# EAGLE design DataLogger (EAGLE 6.3)
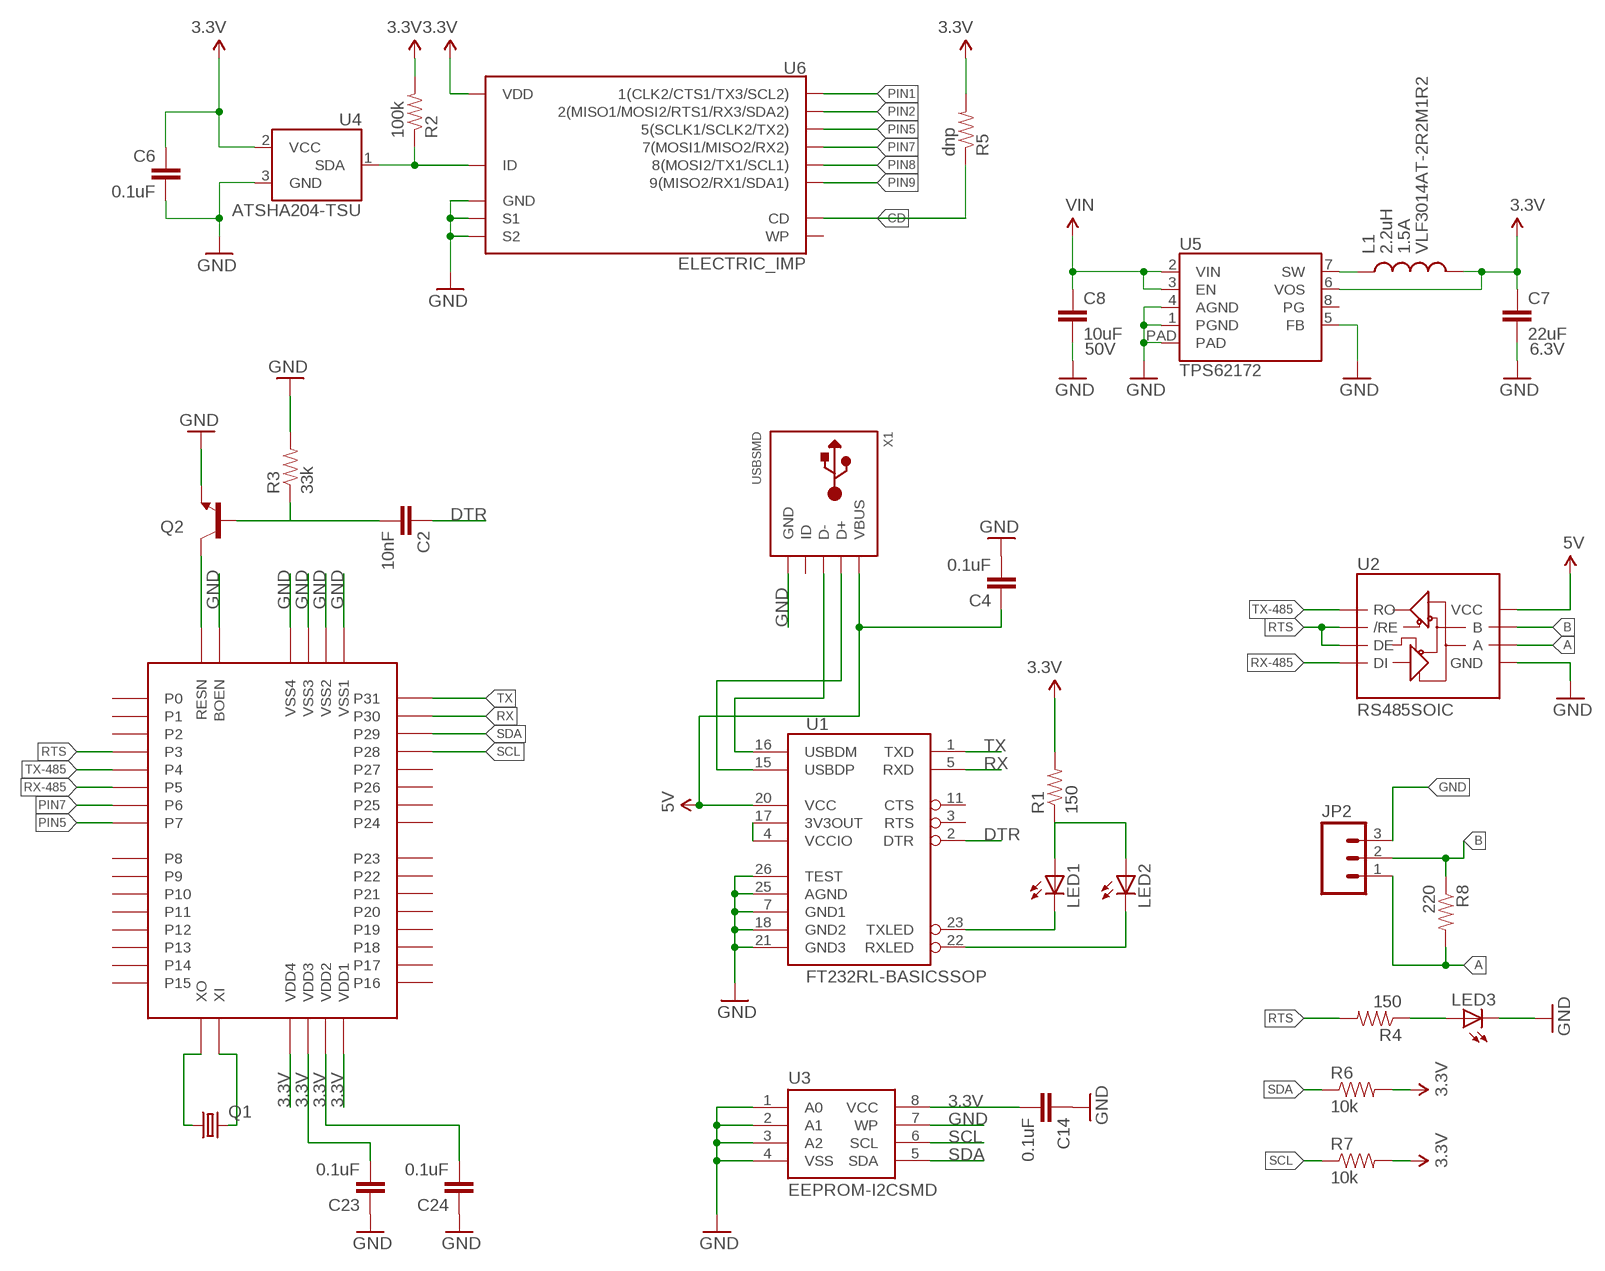
[diagram p0: schematic, sheet 1]

## Parts
C2  10nF  CAP0805  [0805]
C4  0.1uF  CAP1210  [1210]
C6  0.1uF  0.1UF-25V(+80/-20%)(0603)  [0603-CAP]
C7  22uF  22UF-6.3V-20%(0805)  [0805]
C8  10uF  10UF50V20%(1210)  [1210]
C14  0.1uF  CAP0805  [0805]
C23  0.1uF  CAP0805  [0805]
C24  0.1uF  CAP0805  [0805]
JP2  M03PTH  [1X03]
L1  2.2uH  INDUCTORVLF4012A  [VLF4012A]
LED1  LED1206  [LED-1206]
LED2  LED1206  [LED-1206]
LED3  LED1206  [LED-1206]
Q1  CRYSTALSM49  [SM49]
Q2  TRANSISTOR_NPNSOT23  [SOT23]
R1  150  RESISTOR0805-RES  [0805]
R2  100k  100KOHM1/10W1%(0603)  [0603-RES]
R3  33k  RESISTOR0805-RES  [0805]
R4  150  RESISTOR0805-RES  [0805]
R5  dnp  RESISTOR0603  [0603-RES]
R6  10k  RESISTOR0805-RES  [0805]
R7  10k  RESISTOR0805-RES  [0805]
R8  220  RESISTOR0805-RES  [0805]
U1  FT232RL-BASICSSOP  [SSOP28DB]
U2  RS485SOIC  [SO08]
U3  EEPROM-I2CSMD  [SO08]
U4  ATSHA204-TSU  [SOT23-3]
U5  TPS62172  [WSON-8-PAD]
U6  ELECTRIC_IMP  [SD_1:1]
U7  PROPELLERSURFACELQFP  [SURFACEMOUNT]
X1  USBSMD  USBMINIB  [USB-MINIB]

## Nets
3.3V: C6.1 C7.1 C14.2 C23.2 C24.2 L1.P$2 R1.2 R2.2 R5.2 R6.2 R7.2 U3.8(VCC) U4.2(VCC) U5.6(VOS) U6.4(VDD) U7.8(VDD1) U7.18(VDD2) U7.30(VDD3) U7.40(VDD4)
5V: C4.1 C8.1 U1.20(VCC) U2.8(VCC) U5.2(VIN) U5.3(EN) X1.VBUS ; supply symbol labelled VIN
A: JP2.1 R8.2 U2.6(A)
B: JP2.2 R8.1 U2.7(B)
CD: R5.1 U6.CD
DTR: C2.1 C2.2 Q2.1(B) R3.1 U1.2(DTR)
GND: C4.2 C6.2 C7.2 C8.2 C14.1 C23.1 C24.1 JP2.3 LED3.C Q2.2(E) R3.2 U1.7(GND1) U1.18(GND2) U1.21(GND3) U1.25(AGND) U1.26(TEST) U2.5(GND) U3.1(A0) U3.2(A1) U3.3(A2) U3.4(VSS) U3.7(WP) U4.3(GND) U5.1(PGND) U5.4(AGND) U5.5(FB) U5.PAD U6.3(GND) U6.SH@1(S1) U6.SH@2(S2) U7.5(VSS1) U7.6(BOEN) U7.17(VSS2) U7.27(VSS3) U7.39(VSS4) X1.GND
ID: R2.1 U4.1(SDA) U6.6(ID)
N$1: U1.16(USBDM) X1.D-
N$2: U1.15(USBDP) X1.D+
N$3: Q2.3(C) U7.7(RESN)
N$4: U1.4(VCCIO) U1.17(3V3OUT)
N$5: Q1.2 U7.28(XI)
N$6: Q1.1 U7.29(XO)
N$7: L1.P$1 U5.7(SW)
N$8: LED1.C U1.23(TXLED)
N$9: LED2.C U1.22(RXLED)
N$10: LED1.A LED2.A R1.1
N$13: LED3.A R4.1
PIN1: U6.1(1(CLK2/CTS1/TX3/SCL2))
PIN2: U6.2(2(MISO1/MOSI2/RTS1/RX3/SDA2))
PIN5: U6.5(5(SCLK1/SCLK2/TX2)) U7.4(P7)
PIN7: U6.7(7(MOSI1/MISO2/RX2)) U7.3(P6)
PIN8: U6.8(8(MOSI2/TX1/SCL1))
PIN9: U6.9(9(MISO2/RX1/SDA1))
RTS: R4.2 U2.2(/RE) U2.3(DE) U7.44(P3)
RX: U1.5(RXD) U7.37(P30)
RX-485: U2.4(DI) U7.2(P5)
SCL: R7.1 U3.6(SCL) U7.35(P28)
SDA: R6.1 U3.5(SDA) U7.36(P29)
TX: U1.1(TXD) U7.38(P31)
TX-485: U2.1(RO) U7.1(P4)
Unconnected: U1.3(RTS) U1.11(CTS) U5.8(PG) U6.WP U7.9(P8) U7.10(P9) U7.11(P10) U7.12(P11) U7.13(P12) U7.14(P13) U7.15(P14) U7.16(P15) U7.19(P16) U7.20(P17) U7.21(P18) U7.22(P19) U7.23(P20) U7.24(P21) U7.25(P22) U7.26(P23) U7.31(P24) U7.32(P25) U7.33(P26) U7.34(P27) U7.41(P0) U7.42(P1) U7.43(P2) X1.ID

## Notes on the sheet
- 1.5A | VLF3014AT-2R2M1R2
- 50V | 6.3V

## Library data of the parts
C2 C4 C14 C23 C24 = SparkFun:CAP: Capacitor Standard 0603 ceramic capacitor, and 0.1" leaded capacitor.
C6 = SparkFun-Capacitors:0.1UF-25V(+80/-20%)(0603): CAP-00810 Ceramic Standard decoupling cap; PROD_ID: CAP-00810
C7 = SparkFun-Capacitors:22UF-6.3V-20%(0805): CAP-08402 Ceramic; PROD_ID: CAP-08402
C8 = SparkFun-Capacitors:10UF50V20%(1210): CAP-09824; PROD_ID: CAP-09824
JP2 = SparkFun:M03: Header 3 Standard 3-pin 0.1" header. Use with straight break away headers (SKU : PRT-00116), right angle break away headers (PRT-00553), swiss pins (PRT-00743), machine pins (PRT-00117), and female headers (PRT-00115). Molex polarized connector foot print use with SKU : PRT-08232 with associated crimp pins and housings.
L1 = SparkFun-Passives:INDUCTOR: Inductors Basic Inductor/Choke - 0603 and 1206. Footprints are not proven and vary greatly between part numbers.
LED1-LED3 = SparkFun-LED:LED: LEDs Standard schematic elements and footprints for 5mm, 3mm, 1206, and 0603 sized LEDs. 5mm - Spark Fun Electronics SKU : COM-00529 (and others)
Q1 = crystal:CRYSTAL: CRYSTAL; OC_FARNELL: unknown; OC_NEWARK: unknown
Q2 = SparkFun:TRANSISTOR_NPN: Transistor NPN BJT configuration in SOT23 package. MMBT2222 is the common NPN we use. Double check BCE configuration again layout.
R1 R3 R4 R6-R8 = SparkFun:RESISTOR: Resistor Basic schematic elements and footprints for 0603, 1206, and PTH resistors.
R2 = SparkFun-Resistors:100KOHM1/10W1%(0603): RES-07828; PROD_ID: RES-07828
R5 = SparkFun-Resistors:RESISTOR: Resistor Basic schematic elements and footprints for 0603, 1206, and PTH resistors.
U1 = SparkFun-DigitalIC:FT232RL-BASIC: USB UART This is the simplified version of the FT232RL unit. Only what you need, nothing you don't. Spark Fun Electronics SKU : COM-00650
U2 = SparkFun-DigitalIC:RS485: RS485 transceiver
U3 = SparkFun-DigitalIC:EEPROM-I2C: I2C EEPROM chips, 24LC256 (and others)
U4 = SparkFun-DigitalIC:ATSHA204
U5 = SparkFun-PowerIC:TPS62172
U6 = SparkFun-RF:ELECTRIC_IMP: Electric Imp SD Socket This symbol matches the Electric Imp <https://www.sparkfun.com/products/11395> pinout to a 4UCONN SD MMC connector. The 4UCONN part number is 19646 <http://www.4uconnector.com/online/Itemadrawing.asp?fldseries=19646&seriesno_a=12>. See this part in action on the Electric Imp Breakout <https://www.sparkfun.com/products/11400>.; PROD_ID: CONN-11976
U7 = JustinCustom:PROPELLERSURFACE
X1 = adafruit:USB: USB Connectors USBMINIB - Surface Mount Female Mini-B USB Connector 4UConnector: 06564 By microbuilder.eu Thru-hole RA Female Mini-B USB Connector 4UConnector: 18732 By ladyada.net

## Board
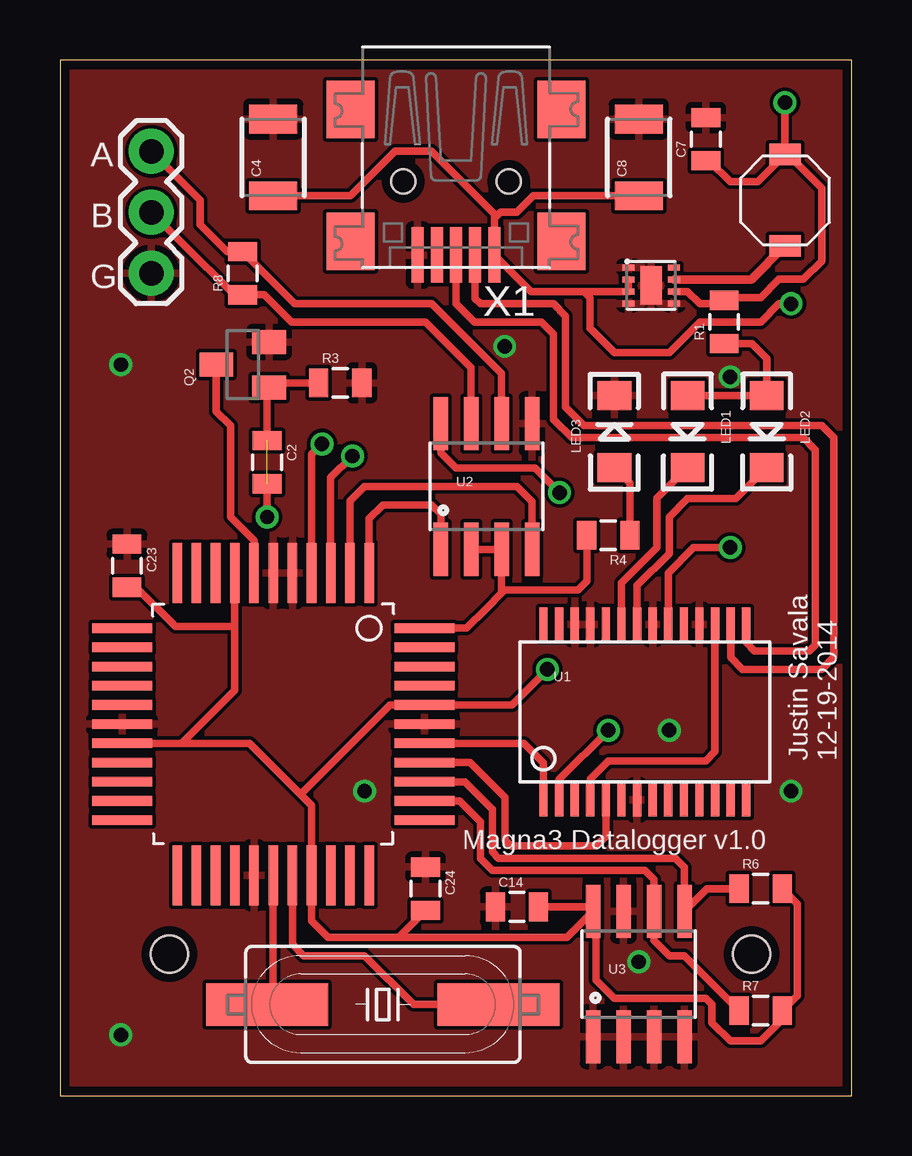
[diagram p1: board, top side]
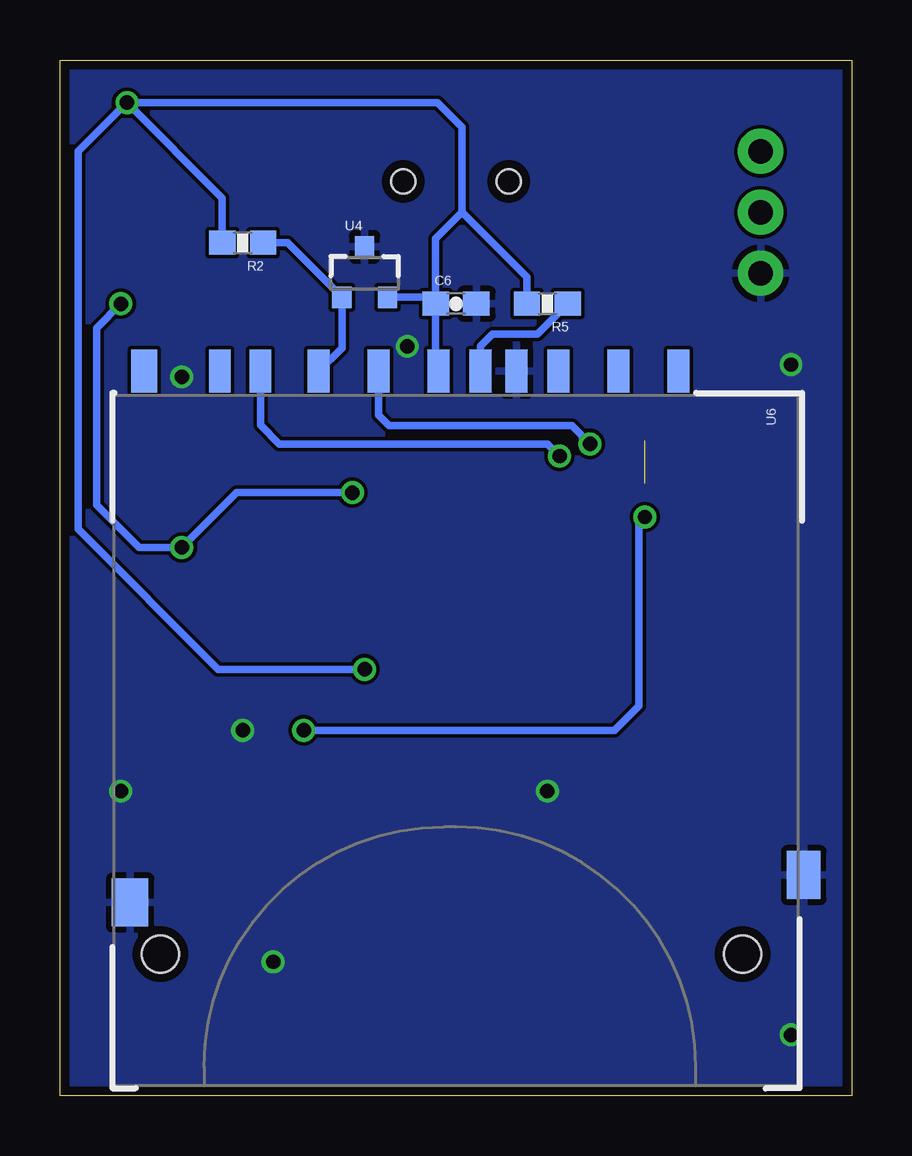
[diagram p2: board, bottom side, seen from below]

Size 33.02 x 43.18 mm. Coordinates in mm from the lower left corner, seen from the top.
Outline: 0,0 33.02,0 33.02,43.18 0,43.18 0,0
Copper layers (1*16): Top 0.0356mm / dielectric 1.5011mm / Bottom 0.0356mm
Design rules "LaenPCBOrder *": minimum track width 6mil, minimum drill 13mil, track to track 6mil, track to pad 6mil, pad to pad 6mil, via to via 6mil, smd to smd 6mil, copper to edge 15mil, drill to drill 6mil, minimum pad ring 7mil, minimum via ring 7mil, stop-mask expansion 2mil, vias tented up to drill 25mil, thermal gap 10mil

### Footprints (pad centres in the part's own frame; a part is rotated, then mirrored left to right if it is on the bottom)
0805 = smd 0.8 x 1.2: 1 -0.9,0; 2 0.9,0
1210 = smd 1.2 x 2: 1 -1.6,0; 2 1.6,0
0603-CAP = smd 1.1 x 1: 1 -0.85,0; 2 0.85,0
1X03 = drill 1.016 pad 1.88: 1 0,0; 2 2.54,0; 3 5.08,0
VLF4012A = smd 0.9 x 1.3: P$1 -1.9,0; P$2 1.9,0
LED-1206 = smd 1.2 x 1.4: A -1.5,0; C 1.5,0
SM49 = smd 5.08 x 1.778: 1 -4.826,0; 2 4.826,0
SOT23 = smd 1 x 1.4: 1 -0.95,-1.1; 2 0.95,-1.1; 3 0,1.1
0603-RES = smd 1.1 x 1: 1 -0.85,0; 2 0.85,0
SSOP28DB = smd 0.348 x 1.397: 1 -4.225,-3.656; 2 -3.575,-3.656; 3 -2.925,-3.656; 4 -2.275,-3.656; 5 -1.625,-3.656; 6 -0.975,-3.656; 7 -0.325,-3.656; 8 0.325,-3.656; 9 0.975,-3.656; 10 1.625,-3.656; 11 2.275,-3.656; 12 2.925,-3.656; 13 3.575,-3.656; 14 4.225,-3.656; 15 4.225,3.656; 16 3.575,3.656; 17 2.925,3.656; 18 2.275,3.656; 19 1.625,3.656; 20 0.975,3.656; 21 0.325,3.656; 22 -0.325,3.656; 23 -0.975,3.656; 24 -1.625,3.656; 25 -2.275,3.656; 26 -2.925,3.656; 27 -3.575,3.656; 28 -4.225,3.656
SO08 = smd 0.61 x 2.21: 1 -1.905,-2.616; 2 -0.635,-2.616; 3 0.635,-2.616; 4 1.905,-2.616; 5 1.905,2.616; 6 0.635,2.616; 7 -0.635,2.616; 8 -1.905,2.616
SOT23-3 = smd 0.8 x 0.9: 1 -0.95,-1; 2 0.95,-1; 3 0,1.1
WSON-8-PAD = smd 0.25 x 0.5: 1 -0.75,-0.95; 2 -0.25,-0.95; 3 0.25,-0.95; 4 0.75,-0.95; 5 0.75,0.95; 6 0.25,0.95; 7 -0.25,0.95; 8 -0.75,0.95 | smd 1.6 x 0.9: PAD 0,0
SD_1:1 = smd 1.8 x 0.9: 1 -1,6.77; 2 -1,4.27; 3 -1,2.52; 4 -1,-0.73; 5 -1,-3.23; 6 -1,-5.73; 7 -1,-8.15; 8 -1,-9.85; 9 -1,9.27; CD -1,1.02 | smd 2 x 1.4: SH@1 20,14.496 | smd 2 x 1.527: SH@2 21.15,-13.589 | smd 1.8 x 1.1: WP -1,-13 | hole 1.55: 23.3,11.94; 23.3,-12.32
SURFACEMOUNT = smd 2.5 x 0.4: 1 -6.3,4; 2 -6.3,3.2; 3 -6.3,2.4; 4 -6.3,1.6; 5 -6.3,0.8; 6 -6.3,0; 7 -6.3,-0.8; 8 -6.3,-1.6; 9 -6.3,-2.4; 10 -6.3,-3.2; 11 -6.3,-4; 23 6.3,-4; 24 6.3,-3.2; 25 6.3,-2.4; 26 6.3,-1.6; 27 6.3,-0.8; 28 6.3,0; 29 6.3,0.8; 30 6.3,1.6; 31 6.3,2.4; 32 6.3,3.2; 33 6.3,4 | smd 0.4 x 2.5: 12 -4,-6.3; 13 -3.2,-6.3; 14 -2.4,-6.3; 15 -1.6,-6.3; 16 -0.8,-6.3; 17 0,-6.3; 18 0.8,-6.3; 19 1.6,-6.3; 20 2.4,-6.3; 21 3.2,-6.3; 22 4,-6.3; 34 4,6.3; 35 3.2,6.3; 36 2.4,6.3; 37 1.6,6.3; 38 0.8,6.3; 39 0,6.3; 40 -0.8,6.3; 41 -1.6,6.3; 42 -2.4,6.3; 43 -3.2,6.3; 44 -4,6.3
USB-MINIB = smd 0.5 x 2.308: D+ 0,4.064; D- -0.8,4.064; GND 1.6,4.064; ID 0.8,4.064; VBUS -1.6,4.064 | smd 2 x 2.4: GND1 -4.4,-2; GND2 -4.4,3.5; GND3 4.4,3.5; GND4 4.4,-2 | hole 1: -2.2,1; 2.2,1

### Placement (x,y rotation side)
C2  8.64,26.42 270 top
C4  8.89,39.12 90 top
C6  16.51,33.02 0 bottom
C7  26.92,39.88 90 top
C8  24.13,39.12 90 top
C14  19.05,7.87 0 top
C23  2.79,22.1 270 top
C24  15.24,8.64 270 top
JP2  3.81,39.37 270 top
L1  30.23,37.34 90 top
LED1  26.16,27.69 270 top
LED2  29.46,27.69 270 top
LED3  23.11,27.69 90 top
Q1  13.46,3.81 180 top
Q2  7.62,30.48 90 top
R1  27.69,32.26 90 top
R2  25.4,35.56 180 bottom
R3  11.68,29.72 0 top
R4  22.86,23.37 180 top
R5  12.7,33.02 180 bottom
R6  29.21,8.64 0 top
R7  29.21,3.56 0 top
R8  7.62,34.29 90 top
U1  24.38,16 0 top
U2  17.78,25.4 0 top
U3  24.13,5.08 0 top
U4  20.32,34.29 0 bottom
U5  24.64,33.78 270 top
U6  16.51,29.21 270 bottom
U7  8.89,15.49 270 top
X1  16.51,39.12 180 top

### Tracks (layer width: path | path; a pad name or v marks a point on that pad's centre or on a via)
3.3V  (via drill 0.6)
  Top 0.305: 22.15,7.62 U3.8 | 12.7,6.6 11.18,6.6 10.49,7.29 U7.30 10.49,12.12 10.03,12.57 | 12.7,6.6 21.13,6.6 U3.8 | U3.8 22.35,7.57 22.35,4.83 23.11,4.06 26.92,4.06 27.18,3.81 27.18,3.05 27.94,2.29 29.21,2.29 30.11,3.19 R7.2 30.73,4.18 30.73,5.33 30.73,8.01 R6.2 | U7.18 5.08,14.69 | 5.08,14.69 7.91,14.69 10.03,12.57 | 10.03,12.57 10.16,12.45 | U7.8 7.29,19.56 | 7.29,19.56 7.29,16.9 5.08,14.69 | 10.03,12.57 13.75,16.29 U7.40 18.83,16.29 v20.32,17.78 | C23.2 3.19,21.2 4.83,19.56 7.29,19.56 | C24.2 14.11,6.6 12.7,6.6 | C14.2 22.05,7.87 U3.8 | U5.6 26.16,33.53 26.67,33.02 27.55,33.02 R1.2 27.8,33.27 29.21,33.27 29.97,34.04 30.99,34.04 31.75,34.8 31.75,37.85 30.36,39.24 L1.P$2 | C7.1 27.06,38.98 27.94,38.1 29.09,38.1 L1.P$2 | L1.P$2 v30.23,41.4
  Bottom 0.305: v20.32,17.78 26.42,17.78 32.26,23.62 32.26,39.37 30.61,41.02 | 30.61,41.02 v30.23,41.4 | R2.2 26.25,37.43 v30.23,41.4 | C6.1 17.36,30.33 U6.4 | R5.2 13.55,34.12 16.26,36.83 | 16.26,36.83 16.26,40.39 17.27,41.4 v30.23,41.4 | v30.23,41.4 30.61,41.02 | U4.2 17.63,33.29 C6.1 | C6.1 17.36,35.73 16.26,36.83
5V  (via drill 0.6)
  Top 0.305: 21.84,33.53 21.59,33.53 19.63,33.53 X1.VBUS 18.11,36.58 | 21.84,33.53 U5.3 U5.2 | U2.8 15.88,26.8 16.51,26.16 19.81,26.16 v20.83,25.15 | v30.48,33.02 29.97,33.02 29.21,32.26 26.67,32.26 25.4,30.99 23.11,30.99 22.1,32 22.1,33.28 21.84,33.53 | U1.20 25.36,21.8 26.42,22.86 v27.94,22.86 | C4.1 12.12,37.52 13.97,39.37 15.49,39.37 18.11,36.75 18.11,36.58 | C8.1 19.74,37.52 19.05,36.83 18.36,36.83 18.11,36.58
  Bottom 0.305: v20.83,25.15 25.65,25.15 v27.94,22.86 29.72,22.86 31.5,24.64 31.5,32 v30.48,33.02
A
  Top 0.305: U2.6 18.41,30.1 15.49,33.02 10.16,33.02 9.79,33.02 R8.2 6.97,35.19 6.6,35.56 5.84,36.32 5.84,37.34 JP2.1
B
  Top 0.305: U2.7 17.14,30.35 15.24,32.26 9.91,32.26 9.65,32.26 8.89,33.02 8.52,33.39 R8.1 7.25,33.39 5.08,35.56 | 5.84,34.8 5.08,35.56 | 5.08,35.56 JP2.2
CD
  Bottom 0.305: U6.CD 15.49,31.25 14.99,31.75 13.12,31.75 R5.1
DTR  (via drill 0.6)  (1 unrouted)
  Top 0.305: U1.2 20.81,13.19 v22.86,15.24 | C2.2 v8.64,24.13 | C2.1 8.64,29.45 Q2.1 8.91,29.72 R3.1
  Bottom 0.305: v22.86,15.24 9.91,15.24 8.89,16.26 8.89,23.88 v8.64,24.13
GND  (via drill 0.6)
  other vias: 18.54,31.24 12.7,12.7 25.4,15.24 24.13,5.59 27.94,29.97 2.54,30.48 2.54,2.54 30.48,12.7
  pour Bottom: 0,43.18 33.02,43.18 33.02,0 0,0
  pour Top: 0,43.18 33.02,43.18 33.02,0 0,0
ID
  Bottom 0.305: U6.6 21.27,31.18 U4.1 23.54,35.56 R2.1
N$1
  Top 0.305: X1.D- 17.31,33.24 17.53,33.02 20.57,33.02 21.08,32.51 21.08,28.7 21.84,27.94 31.75,27.94 32.26,27.43 32.26,18.29 31.75,17.78 29.97,17.78 28.45,17.78 27.96,18.27 U1.16
N$2
  Top 0.305: X1.D+ 16.51,33.02 17.27,32.26 20.07,32.26 20.57,31.75 20.57,28.19 21.34,27.43 30.99,27.43 31.5,26.92 31.5,18.8 31.24,18.54 30.23,18.54 28.96,18.54 28.61,18.89 U1.15
N$3
  Top 0.305: Q2.3 6.52,28.53 7.11,27.94 7.11,24.89 7.11,24.13 8.09,23.15 U7.7
N$4
  Top 0.305: U1.4 22.11,13.22 22.86,13.97 26.92,13.97 27.31,14.36 U1.17
N$5
  Top 0.305: U7.28 8.89,4.06 Q1.2
N$6
  Top 0.305: Q1.1 14.73,3.81 12.7,5.84 10.16,5.84 9.69,6.31 U7.29
N$7
  Top 0.356: U5.7 28.82,34.03 L1.P$1
N$8
  Top 0.305: U1.23 23.41,21.38 24.89,22.86 24.89,24.92 LED1.C
N$9
  Top 0.305: U1.22 24.06,21.27 25.4,22.61 25.4,24.13 26.16,24.89 28.17,24.89 LED2.C
N$10
  Top 0.305: R1.1 28.84,31.36 29.46,30.73 LED2.A LED1.A
N$13
  Top 0.305: R4.1 23.76,25.54 LED3.A
PIN5  (via drill 0.6)
  Top 0.305: U7.4 10.49,26.75 v10.92,27.18
  Bottom 0.305: U6.5 19.74,28.38 19.3,27.94 11.68,27.94 v10.92,27.18
PIN7  (via drill 0.6)
  Top 0.305: U7.3 11.29,25.77 v12.19,26.67
  Bottom 0.305: U6.7 24.66,27.96 23.88,27.18 12.7,27.18 v12.19,26.67
RTS
  Top 0.305: 18.41,20.95 18.41,21.08 U2.3 U2.2 | 18.41,20.95 17.78,20.32 16.95,19.49 U7.44 | 18.41,20.95 18.54,21.08 21.59,21.08 21.96,21.45 R4.2
RX
  Top 0.305: U7.37 17.09,13.89 18.54,12.45 18.54,10.67 18.8,10.41 22.35,10.41 22.76,10.82 U1.5
RX-485
  Top 0.305: U2.4 19.68,24.77 19.05,25.4 13.97,25.4 12.7,25.4 12.09,24.79 U7.2
SCL
  Top 0.305: U7.35 16.66,12.29 17.53,11.43 17.53,9.91 18.03,9.4 24.38,9.4 24.77,9.02 U3.6 24.77,6.48 25.4,5.84 26.02,5.84 R7.1
SDA
  Top 0.305: U7.36 16.88,13.09 18.03,11.94 18.03,10.16 18.29,9.91 25.65,9.91 26.04,9.53 U3.5 26.98,8.64 R6.1
TX
  Top 0.305: U7.38 19.34,14.69 19.81,14.22 20.16,13.88 U1.1
TX-485
  Top 0.305: U7.1 12.89,24.07 13.46,24.64 15.49,24.64 15.88,24.26 U2.1

### Text on the board
tNames: A | B | G | Justin Savala / 12-19-2014 | Magna3 Datalogger v1.0